# EAGLE design esp8266_schematic (EAGLE 9.4.2)
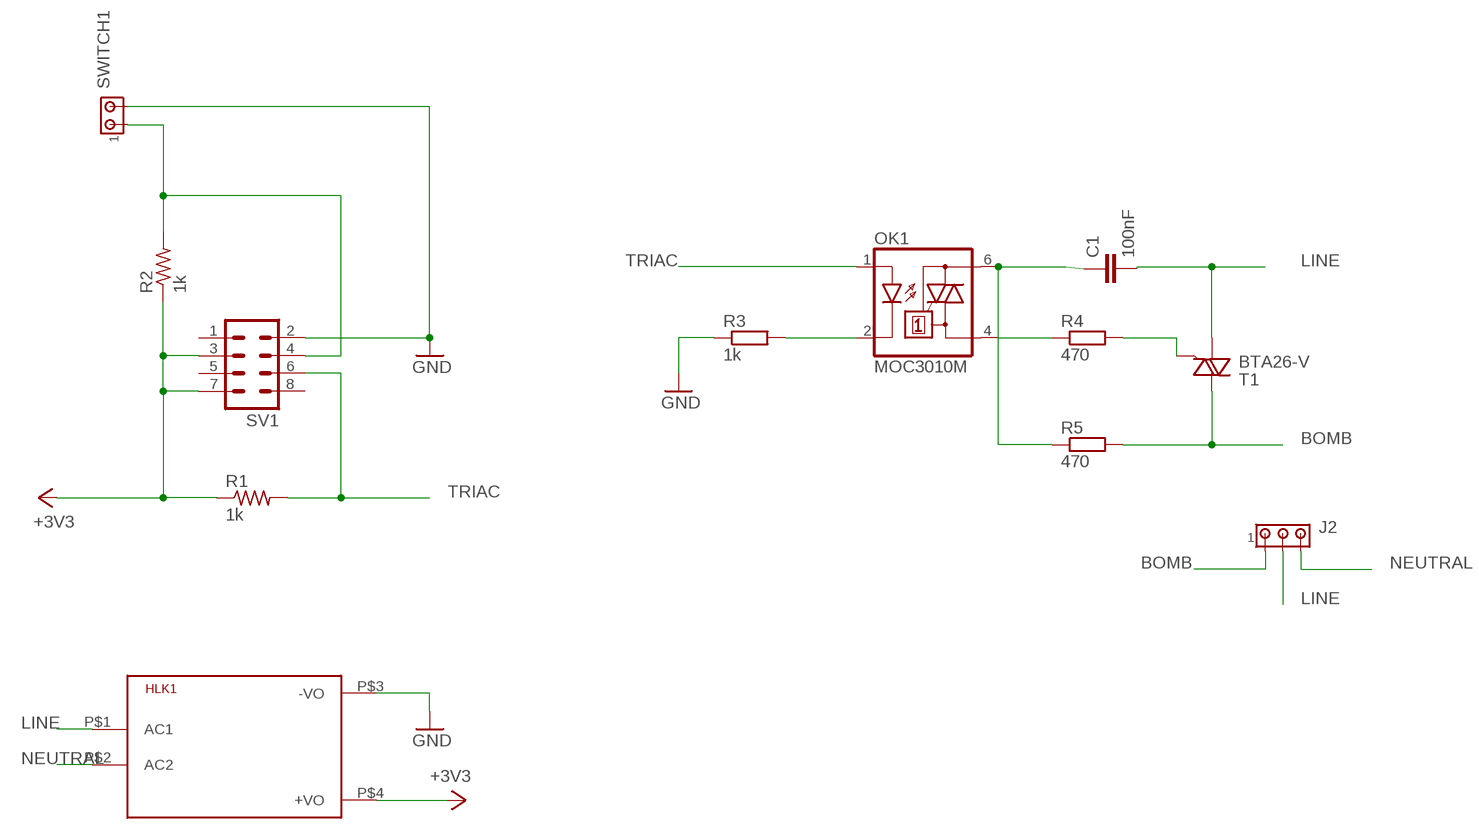
[diagram p0: schematic, sheet 1]

## Parts
C1  100nF  C-EU102-043X133  [C102-043X133]
HLK1  HLK-PM013W  [HLK-PM01]
J2  MTA03-100  [10X03MTA]
OK1  MOC3010M  [DIL06]
R1  1k  R-US_0207/2V  [0207/2V]
R2  1k  R-US_0207/2V  [0207/2V]
R3  1k  R-EU_0204/5  [0204/5]
R4  470  R-EU_0207/15  [0207/15]
R5  470  R-EU_0207/15  [0207/15]
SV1  MA04-2  [MA04-2]
SWITCH1  MTA02-100  [10X02MTA]
T1  BTA26-V  [TOP3S-1]

## Nets
+3V3: HLK1.P$4(+VO) R1.1 R2.1 SV1.3 SV1.7
BOMB: J2.1 R5.2 T1.A2
GND: HLK1.P$3(-VO) R3.1 SV1.2 SWITCH1.2
LINE: C1.2 HLK1.P$1(AC1) J2.2 T1.A1
N$1: OK1.2(C) R3.2
N$3: R2.2 SV1.4 SWITCH1.1
N$4: C1.1 OK1.6(A2) R5.1
N$5: OK1.4(A1) R4.1
N$6: R4.2 T1.G
NEUTRAL: HLK1.P$2(AC2) J2.3
TRIAC: OK1.1(A) R1.2 SV1.6
Unconnected: SV1.1 SV1.5 SV1.8

## Library data of the parts
C1 = rcl:C-EU: CAPACITOR, European symbol; SPICEPREFIX: C
HLK1 = HLK-PM01:HLK-PM01: Hi-Link Power Supply HLK-PM01 3W Author: Ahmed Said <https://github.com/AhmedSaid/EAGLELibraries>
J2 = con-amp:MTA03-100: AMP connector
OK1 = optocoupler:MOC30*M: RANDOM-PHASE OPTOISOLATORS TRIAC DRIVER OUTPUT Source: http://www.fairchildsemi.com MOC3020-M.pdf; MF: FAIRCHILD SEMICONDUCTOR; MPN: MOC3010-M; OC_FARNELL: 1505423; OC_NEWARK: 72K8892
R1 R2 = rcl:R-US_: RESISTOR, American symbol; SPICEPREFIX: R
R3-R5 = rcl:R-EU_: RESISTOR, European symbol; SPICEPREFIX: R
SV1 = con-lstb:MA04-2: PIN HEADER; OC_FARNELL: unknown; OC_NEWARK: unknown
SWITCH1 = con-amp:MTA02-100: AMP connector
T1 = triac:BTA26: 25A TRIAC Source: http://www.st.com/stonline/products/literature/ds/7470.pdf

## Board
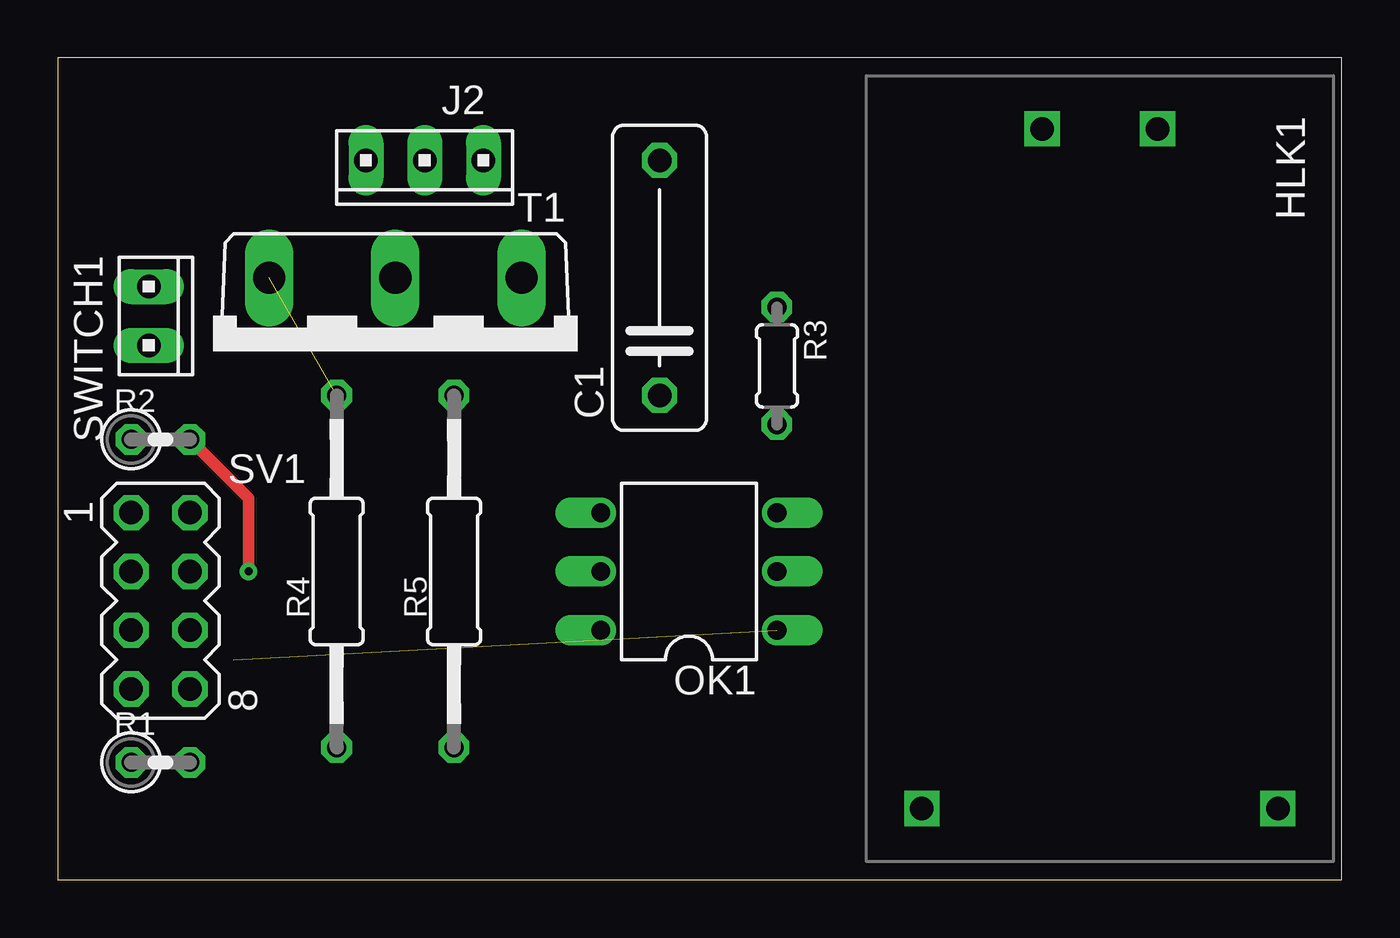
[diagram p1: board, top side]
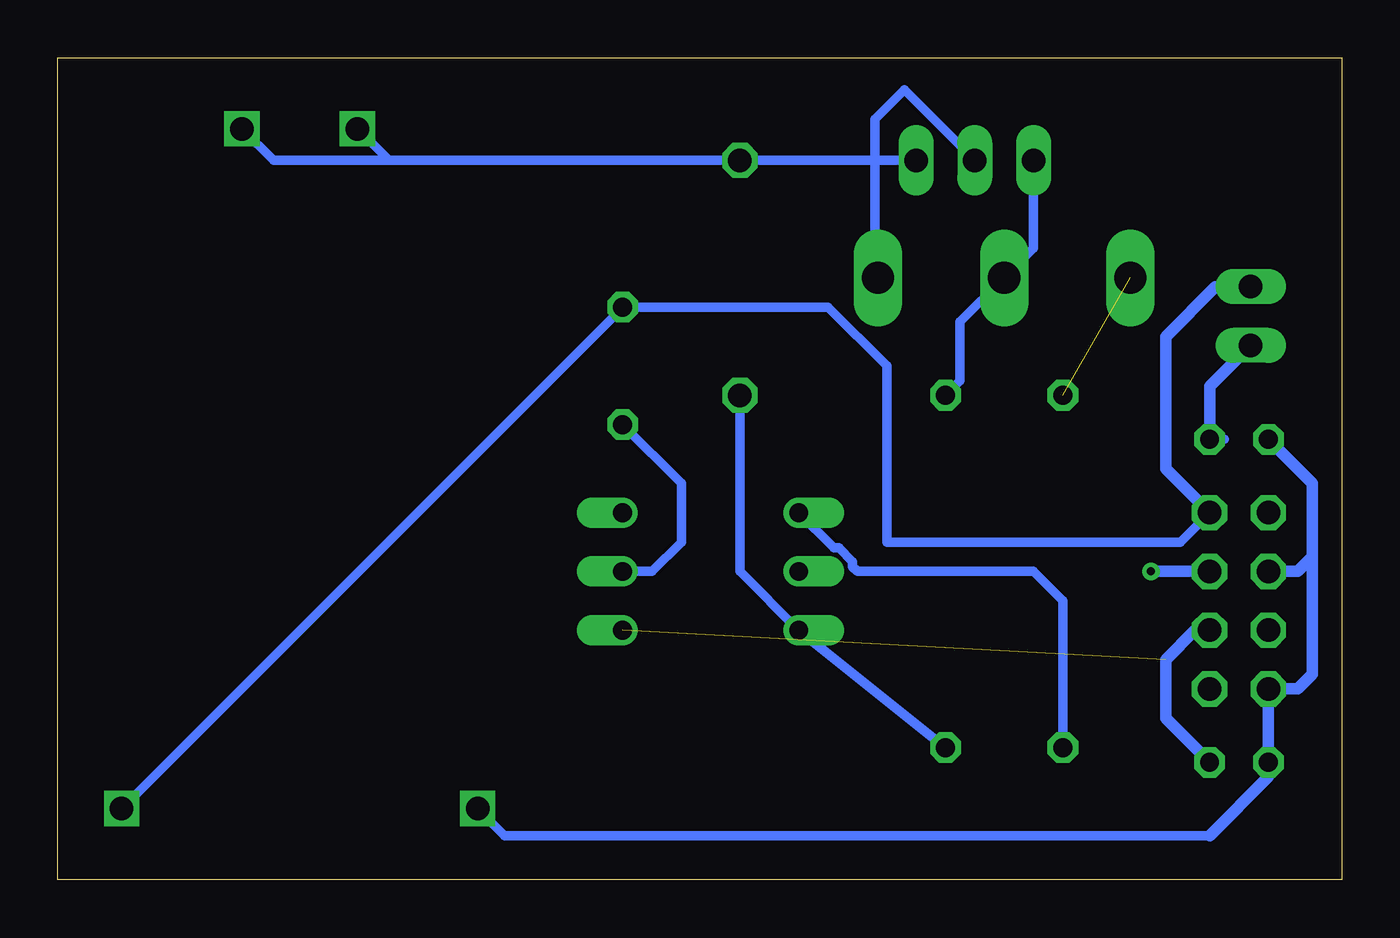
[diagram p2: board, bottom side, seen from below]

Size 55.55 x 35.55 mm. Coordinates in mm from the lower left corner, seen from the top.
Outline: 0,0 55.55,0 55.55,35.55 0,35.55 0,0
Copper layers (1*16): Top 0.035mm / dielectric 1.5mm / Bottom 0.035mm
Design rules "default *": minimum track width 10mil, minimum drill 0.35mm, track to track 6mil, track to pad 1mil, pad to pad 6mil, via to via 6mil, smd to smd 6mil, copper to edge 40mil, drill to drill 6mil, minimum pad ring 10mil, minimum via ring 8mil, stop-mask expansion 4mil, vias tented up to drill 0mil, thermal gap 10mil

### Footprints (pad centres in the part's own frame; a part is rotated, then mirrored left to right if it is on the bottom)
C102-043X133 = drill 1.016 octagon: 1 -5.08,0; 2 5.08,0
HLK-PM01 = drill 1.016 square: P$1 -14.7,2.5; P$2 -14.7,-2.5; P$3 14.7,7.7; P$4 14.7,-7.7
10X03MTA = drill 1.016 long: 1 2.54,0; 2 0,0; 3 -2.54,0
DIL06 = drill 0.813 offset: 1 -2.54,-3.81; 2 0,-3.81; 3 2.54,-3.81; 4 2.54,3.81; 5 0,3.81; 6 -2.54,3.81
0207/2V = drill 0.813 octagon: 1 -1.27,0; 2 1.27,0
0204/5 = drill 0.813 octagon: 1 -2.54,0; 2 2.54,0
0207/15 = drill 0.813 octagon: 1 -7.62,0; 2 7.62,0
MA04-2 = drill 1.016 octagon: 1 -3.81,-1.27; 2 -3.81,1.27; 3 -1.27,-1.27; 4 -1.27,1.27; 5 1.27,-1.27; 6 1.27,1.27; 7 3.81,-1.27; 8 3.81,1.27
10X02MTA = drill 1.016 long: 1 1.27,0; 2 -1.27,0
TOP3S-1 = drill 1.397 long: A1 -5.461,-3.175; A2 0,-3.175; G 5.461,-3.175

### Placement (x,y rotation side)
C1  26.03,26.04 90 top
HLK1  45.09,17.78 270 top
J2  15.87,31.11 180 top
OK1  27.3,13.34 90 top
R1  4.44,5.08 0 top
R2  4.44,19.05 0 top
R3  31.11,22.22 270 top
R4  12.06,13.34 90 top
R5  17.14,13.34 90 top
SV1  4.44,12.07 270 top
SWITCH1  3.94,24.38 270 top
T1  14.6,22.86 180 top

### Tracks (layer width: path | path; a pad name or v marks a point on that pad's centre or on a via)
+3V3
  Bottom 0.406: HLK1.P$4 36.21,1.91 5.71,1.91
  Bottom 0.508: R2.1 1.27,17.14 1.27,13.97 | 1.27,13.97 1.9,13.34 SV1.3 | 1.27,13.97 1.27,8.89 1.9,8.25 SV1.7 R1.1 3.17,4.45 5.71,1.91
BOMB
  Bottom 0.406: R5.2 16.51,21.59 16.51,24.13 T1.A2 13.33,27.3 J2.1
GND
  Bottom 0.406: SV1.2 6.98,14.61 19.69,14.61 19.69,22.22 22.23,24.77 R3.1 31.11,24.75 HLK1.P$3
  Bottom 0.508: SV1.2 7.62,17.78 7.62,23.5 5.46,25.65 SWITCH1.2
LINE
  Bottom 0.406: HLK1.P$1 46.22,31.11 C1.2 21.97,31.11 | T1.A1 20.19,25.91 20.19,32.89 18.92,34.16 J2.2
N$1
  Bottom 0.406: OK1.2 29.84,13.34 28.57,14.61 28.57,17.14 R3.2
N$3  (via drill 0.35)
  Top 0.508: R2.2 8.26,16.51 v8.26,13.34
  Bottom 0.406: R2.2 5.08,19.05
  Bottom 0.508: R2.2 5.71,21.34 SWITCH1.1 | SV1.4 v8.26,13.34
N$4
  Bottom 0.406: C1.1 26.03,13.34 OK1.6 R5.1
N$5
  Bottom 0.406: OK1.4 21.97,14.35 21.75,14.35 21.16,13.76 21.16,13.54 20.95,13.34 13.33,13.34 12.06,12.07 R4.1
N$6  (1 unrouted)
NEUTRAL
  Bottom 0.406: HLK1.P$2 41.22,31.11 J2.3
TRIAC  (1 unrouted)
  Bottom 0.508: R1.2 7.62,6.99 7.62,9.52 6.35,10.8 SV1.6